# Altium schematic sheet Peripherals.SchDoc: Wacky Racer Peripherals
size A3; Author: IPA & DHA; DrawnBy: IPA & DHA; Organization: Group 33; Address1: ECE Department; Address2: University of Canterbury; Address3: Christchurch 8041; Address4: New Zealand; DocumentNumber: 006; Revision: 1; SheetNumber: 2; SheetTotal: 3; ImagePath: \\maxwell\elecapp\AltiumDesigner\Templates\uc-logo.png
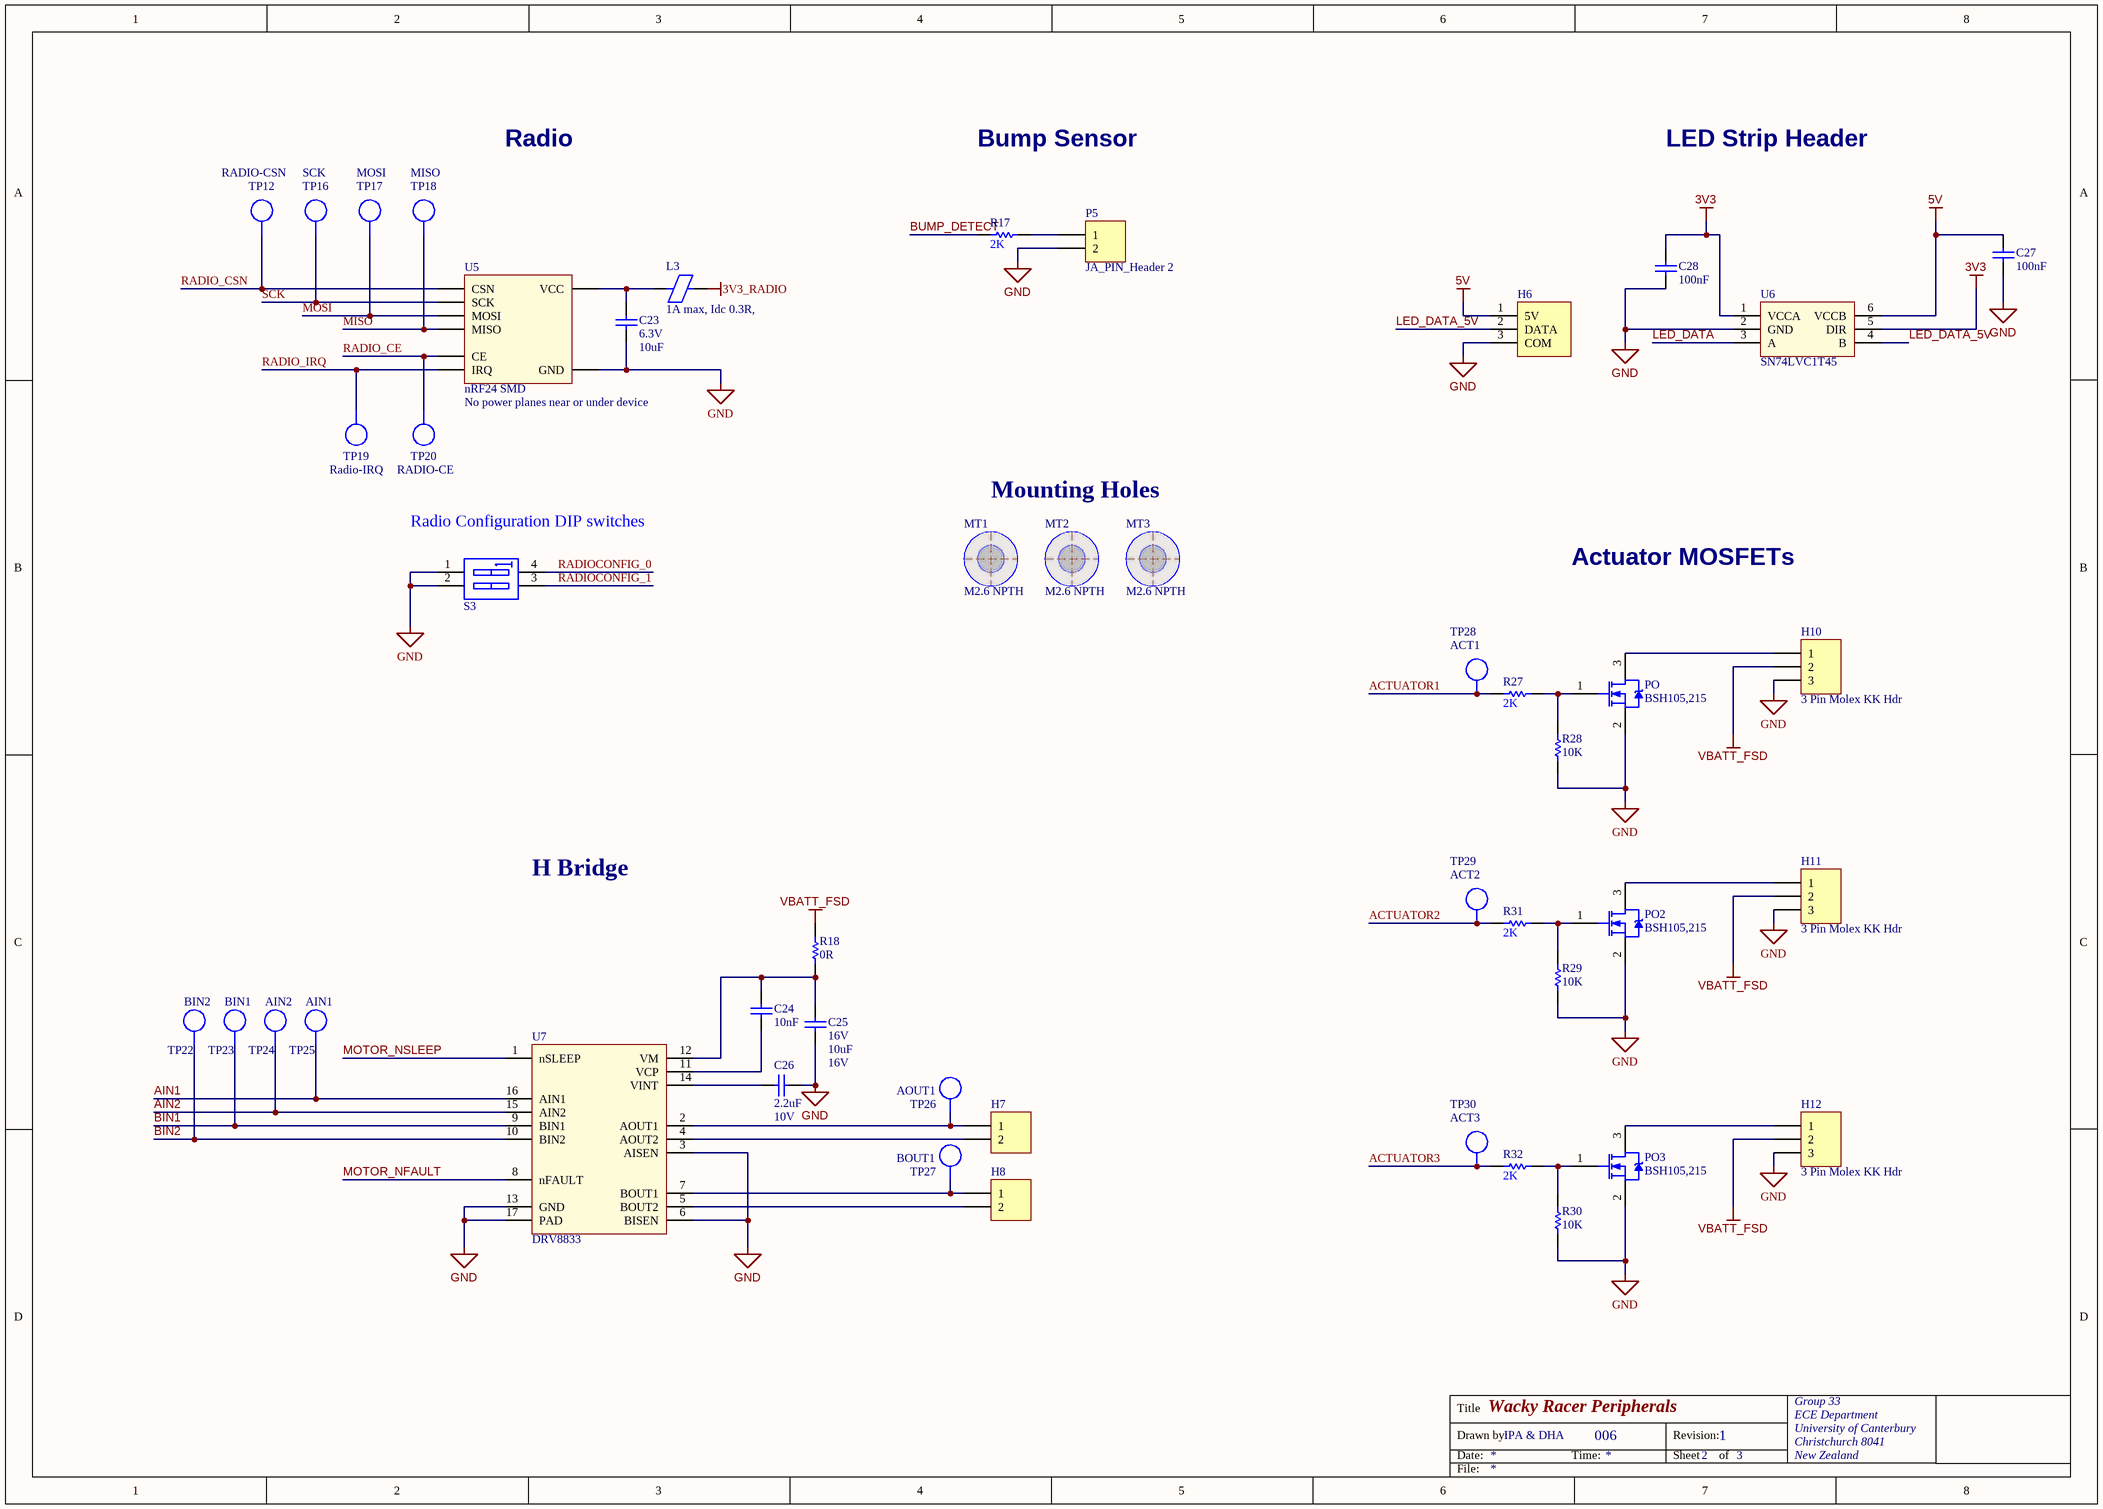
[diagram p0: Peripherals.SchDoc]

## Parts
C23  Voltage - Rated: 6.3V  [CAPC1608L]  (hidden comment: 10uF)
C24  10nF  [CAPC1608L]
C25  Voltage - Rated: 16V  [CAPC2012L]  (hidden comment: 10uF)
C26  Max Voltage: 10V  [CAPC1608L]  (hidden comment: 2.2uF)
C27  100nF  [CAPC1608L]
C28  100nF  [CAPC1608L]
H6  3 Pin Molex KK Hdr  [MOLEX_KK_3_HDR]  (value not drawn)
H7  JA_TERM_BLK_HDR_2 PIN  [TMHDR2]  (value not drawn)
H8  JA_TERM_BLK_HDR_2 PIN  [TMHDR2]  (value not drawn)
H10  3 Pin Molex KK Hdr  [MOLEX_KK_3_HDR]
H11  3 Pin Molex KK Hdr  [MOLEX_KK_3_HDR]
H12  3 Pin Molex KK Hdr  [MOLEX_KK_3_HDR]
L3  1A max, Idc 0.3R,  [INDC3216L]
MT1  M2.6 NPTH  [MNT-HOLE_2.6mm_NPTH]  (no BOM)
MT2  M2.6 NPTH  [MNT-HOLE_2.6mm_NPTH]  (no BOM)
MT3  M2.6 NPTH  [MNT-HOLE_2.6mm_NPTH]  (no BOM)
P5  JA_PIN_Header 2  [HDR1X2]
PO  BSH105,215  [SOT23_L]
PO2  BSH105,215  [SOT23_L]
PO3  BSH105,215  [SOT23_L]
R17  2K  [RESC1608L]
R18  0R  [RESC3216L]
R27  2K  [RESC1608L]
R28  10K  [RESC1608L]
R29  10K  [RESC1608L]
R30  10K  [RESC1608L]
R31  2K  [RESC1608L]
R32  2K  [RESC1608L]
S3  WS_SW DIP-2  [DIP_SW_2WAY_SMD]  (value not drawn)
TP12  RADIO-CSN  [TP_1206]  (no BOM)
TP16  SCK  [TP_1206]  (no BOM)
TP17  MOSI  [TP_1206]  (no BOM)
TP18  MISO  [TP_1206]  (no BOM)
TP19  Radio-IRQ  [TP_1206]  (no BOM)
TP20  RADIO-CE  [TP_1206]  (no BOM)
TP22  BIN2  [TP_1206]  (no BOM)
TP23  BIN1  [TP_1206]  (no BOM)
TP24  AIN2  [TP_1206]  (no BOM)
TP25  AIN1  [TP_1206]  (no BOM)
TP26  AOUT1  [TP_1206]  (no BOM)
TP27  BOUT1  [TP_1206]  (no BOM)
TP28  ACT1  [TP_1206]  (no BOM)
TP29  ACT2  [TP_1206]  (no BOM)
TP30  ACT3  [TP_1206]  (no BOM)
U5  nRF24 SMD  Warning: No power planes near or under device  [NRF24]
U6  SN74LVC1T45  [SOT23-6_N]
U7  DRV8833  [HTSOP16 DRV8833]

## Nets
3V3: C28.2 U6.1(VCCA) U6.5(DIR)
3V3_RADIO: L3.2
5V: C27.2 H6.1(5V) U6.6(VCCB)
GND: C23.1 C25.1 C26.2 C27.1 C28.1 H6.3(COM) H10.3 H11.3 H12.3 P5.2 PO.2 PO2.2 PO3.2 R28.1 R29.1 R30.1 S3.1(A1) S3.2(A2) U5.2(GND) U6.2(GND) U7.3(AISEN) U7.6(BISEN) U7.13(GND) U7.17(PAD)
VBATT_FSD: H10.2 H11.2 H12.2 R18.2
ACTUATOR1: R27.1 TP28.1
ACTUATOR2: R31.1 TP29.1
ACTUATOR3: R32.1 TP30.1
AIN1: TP25.1 U7.16(AIN1)
AIN2: TP24.1 U7.15(AIN2)
BIN1: TP23.1 U7.9(BIN1)
BIN2: TP22.1 U7.10(BIN2)
BUMP_DETECT: R17.1
LED_DATA: U6.3(A)
LED_DATA_5V: H6.2(DATA) U6.4(B)
MISO: TP18.1 U5.7(MISO)
MOSI: TP17.1 U5.6(MOSI)
MOTOR_NFAULT: U7.8(nFAULT)
MOTOR_NSLEEP: U7.1(nSLEEP)
RADIO_CE: TP20.1 U5.3(CE)
RADIO_CSN: TP12.1 U5.4(CSN)
RADIO_IRQ: TP19.1 U5.8(IRQ)
RADIOCONFIG_0: S3.4(B1)
RADIOCONFIG_1: S3.3(B2)
SCK: TP16.1 U5.5(SCK)
NetC23_2: C23.2 L3.1 U5.1(VCC)
NetC24_1: C24.1 U7.11(VCP)
NetC24_2: C24.2 C25.2 R18.1 U7.12(VM)
NetC26_1: C26.1 U7.14(VINT)
NetH7_1: H7.1 TP26.1 U7.2(AOUT1)
NetH7_2: H7.2 U7.4(AOUT2)
NetH8_1: H8.1 TP27.1 U7.7(BOUT1)
NetH8_2: H8.2 U7.5(BOUT2)
NetH10_1: H10.1 PO.3
NetH11_1: H11.1 PO2.3
NetH12_1: H12.1 PO3.3
NetP5_1: P5.1 R17.2
NetPO2_1: PO2.1 R29.2 R31.2
NetPO3_1: PO3.1 R30.2 R32.2
NetPO_1: PO.1 R27.2 R28.2

## Notes on the sheet
- Radio
- Bump Sensor
- LED Strip Header
- Mounting Holes
- (near S3) Radio Configuration DIP switches
- Actuator MOSFETs
- H Bridge
- Title
- Drawn by:
- Date:
- Time:
- Revision:
- Sheet
- of
- File:

## Library data of the parts
C23 = CC_10uF_0603: CAP CER 10UF X5R +-20% 6V3 0603; Supplier: ECE Dept; Storage Location: PCB Assembly WS; Value: 10uF
C24 = CC_10nF_0603: CAP CER 10nF X7R +-10% 50V 0603; PackageReference: 0603; Code_IPC: 1608 [0603]; Verify: *; Supplier: ECE Dept; Storage Location: PCB Assembly WS; Value: 10nF
C25 = CC_10uF_0805_16V: CAP CER 10uF X5R 16V 0805; Manufacturer: Samsung Electro-Mechanics; Manufacturer Part Number: CL21A106KOQNNWE; Note: Footprint corresponds to dimensions for bulk cassette packaging. This case size has tightened tolerances.; Tolerance: ±10%; Notification: Current market demand for these product types have resulted in fluctuating and extending lead times. Lead times may differ.; PackageReference: 0805; Code_IPC: 2012[0805]; Supplier 1: Digi-Key; RoHS: RoHS Compliant; Category: Capacitors; Stock 1: 20000; Pricing 1: 1=0.35, 10=0.25, 100=0.1178, 500=0.08254, 1000=0.06831 (NZD); Packaging: Cut Tape (CT); Part Status: Active; Temperature Coefficient: X5R; Operating Temperature: -55°C ~ 85°C; Features: -; Ratings: -; Applications: General Purpose; Mounting Type: Surface Mount, MLCC; Package / Case: 0805 (2012 Metric); Size / Dimension: 0.079" L x 0.049" W (2.00mm x 1.25mm); Height - Seated (Max): -; Thickness (Max): 0.055" (1.40mm); Lead Spacing: -; Lead Style: -; ComponentLink1URL: http://www.samsungsem.com/kr/support/product-search/mlcc/CL21A106KOQNNWE.jsp; ComponentLink1Description: http://www.samsungsem.com/kr/support/product-search/mlcc/CL21A106KOQNNWE.jsp; Supplier Part Number 1: 1276-2894-1-ND; Value: 10uF; Max Voltage: 16V
C26 = CC_2.2uF_0603: CAP CER 2.2uF X5R +-20% 10V 0603; PackageReference: 0603; Code_IPC: 1608 [0603]; Verify: *; Supplier: ECE Dept; Storage Location: PCB Assembly WS; Value: 2.2uF
C27 C28 = CC_100nF_0603: CAP CER 100nF X7R +-10% 50V 0603; PackageReference: 0603; Code_IPC: 1608 [0603]; Verify: *; Supplier: ECE Dept; Storage Location: PCB Assembly WS; Value: 100nF
H6 = LED_Strip_Header: CONN HEADER 3POS 2.54mm VERT_Thru Hole; Manufacturer: Molex; Manufacturer PN: 22-23-2031; Supplier Part Number 1: 9731156; Supplier: ECE Dept; Supplier 1: Farnell; Storage Location: ECE Dept Store; Value: 3 Pin Molex KK Hdr
H7 H8 = JA_TERM_BLK_HDR_2 PIN: TERM_BLK_HEADER 5.08mm 2 Pos R/A Thru Hole; Manufacturer: Phoenix Contact; Manufacturer Part Number: 1727010; Max Supply Voltage: 160V; Max Current Rating: 12A; Verify: *; Supplier Part Number 1: 3704579; Supplier: ECE Dept; Supplier 1: Farnell; Storage Location: ECE Dept Store; Supplier 2: Digi-Key; Supplier Part Number 2: 277-1947-ND
H10-H12 = JA_MOLEX_KK_3POS: CONN HEADER 3POS 2.54mm VERT_Thru Hole; Manufacturer: Molex; Manufacturer PN: 22-23-2031; Supplier Part Number 1: 9731156; Supplier: ECE Dept; Supplier 1: Farnell; Storage Location: ECE Dept Store; Value: 3 Pin Molex KK Hdr
L3 = IN_Ferrite-Bead: Ferrite Bead, Rdc 0.3R, Z100MHZ 600R, Imax 1A, SMD 1206; Manufacturer: FAIR-RITE; Manufacturer PN: 2512066017Y1; DC Current Rating: 1; DC Resistance Max: 0.08; Ferrite Case Style: 1206 ^3216 Metric]; Frequency Range: 50MHz to 1; Impedance: 600; Impedance Tolerance: ± 25%; Supplier: ECE Dept; Storage Location: PCB Assembly WS; Ferrite Mounting: SMD; Supplier 1: Farnell; Supplier Part Number 1: 1612060; Manufacturer Part Number: 2512066017Y1; Value: 1A max, Idc 0.3R,
MT1-MT3 = MC_M2.6_HOLE: Fixing M2.6 Mount Hole NPTH; Manufacturer: Hi-Q; Manufacturer PN: 2BV series M2.5 Clearance; price: 0; Supplier: ECE Dept; value: M2.6 NPTH
P5 = JA_PIN_Header 2: Header, 2-Pin; LatestRevisionDate: 17-Jul-2002; LatestRevisionNote: Re-released for DXP Platform.; Publisher: Altium Limited
PO PO2 PO3 = TM_BSH105: MOSFET N-CH 20V 1.05A SOT-23; Manufacturer: NXP Semiconductors; FET Type: MOSFET N-Channel, Metal Oxide; Gate Charge (Qg) @ Vgs: 3.9nC @ 4.5V; Input Capacitance (Ciss) @ Vds: 152pF @ 16V; Power - Max: 417mW; Rds On (Max) @ Id, Vgs: 200 mOhm @ 600mA, 4.5V; Supplier 1: Farnell; Supplier 2: Digi-Key; Current - Continuous Drain (Id) @ 25° C: 1.05A; Drain to Source Voltage (Vdss): 20V; Package / Case: TO-236-3, SC-59, SOT-23-3; Pricing: 1=0.53, 10=0.42, 25=0.3544, 100=0.2885, 250=0.23896, 500=0.1974, 1000=0.14785 (NZD); Supplier Part Number 1: 1758066; Supplier Part Number 2: 568-6215-1-ND; Storage Location: PCB Assembly WS; Supplier: ECE Dept; Manufacturer Part Number: BSH105,215
R17 R27 R31 R32 = RS_2K: RES 2K OHM 1/10W 5% 0603 SMD; Storage Location: PCB Assembly WS; Supplier: ECE Dept; Value: 2K
R18 = RT_0R: RES 0R OHM 1/8W 5% 1206 SMD; Storage Location: PCB Assembly WS; Supplier: ECE Dept; Value: 0R
R28-R30 = RS_10K: RES 10.0K OHM 1/10W 5% 0603 SMD; Storage Location: PCB Assembly WS; Supplier: ECE Dept; Value: 10K
S3 = WS_SW DIP-2: DIP Switch, 2 Position, SPST SMD; Manufacturer: OMRON ELECTRONIC COMPONENTS; Manufacturer Part Number: A6SN-2101; Contact Current DC Max: 25; External Length / Height: 7; No. of Switch Positions: 2; Pitch Spacing: 2.54; PackageReference: DIP-4; Contact Configuration: SPST; Supplier 1: Farnell; Supplier Part Number 1: 2029424; Storage Location: PCB Assembly WS; Supplier: ECE Dept
TP12 TP16-TP20 TP22-TP30 = TP_1206: Test-Point 3.3x1.6x2.1mm SMD; Manufacturer: Harwin Inc; Manufacturer Part Number: S1751-46R; Value: TP; Manufacturer PN: *; Storage Location: ProtoPlace; Mounting Type: Surface Mount; Type: PC Test Point; Supplier 1: Digi-Key; Supplier Part Number 1: 952-1478-2-ND; Supplier 2: Farnell; Supplier Part Number 2: 1826282; Supplier: ECE Dept
U5 = NRF24: nRF24 SMD Module
U6 = SN74LVC1T45: 1.8V - 5V level converter
U7 = DRV8833: Dual H-Bridge Motor Driver 1.5A; ComponentLink1Description: DRV8833 Datasheet; ComponentLink1URL: \\maxwell\elecapp\AltiumDesigner\Libraries\DatasheetsNew\ENCE461\drv8833pwpr.pdf